# Altium schematic sheet 09-NORStatusLed.SchDoc
size A4; DocumentNumber: 9; SheetNumber: 9; SheetTotal: 26
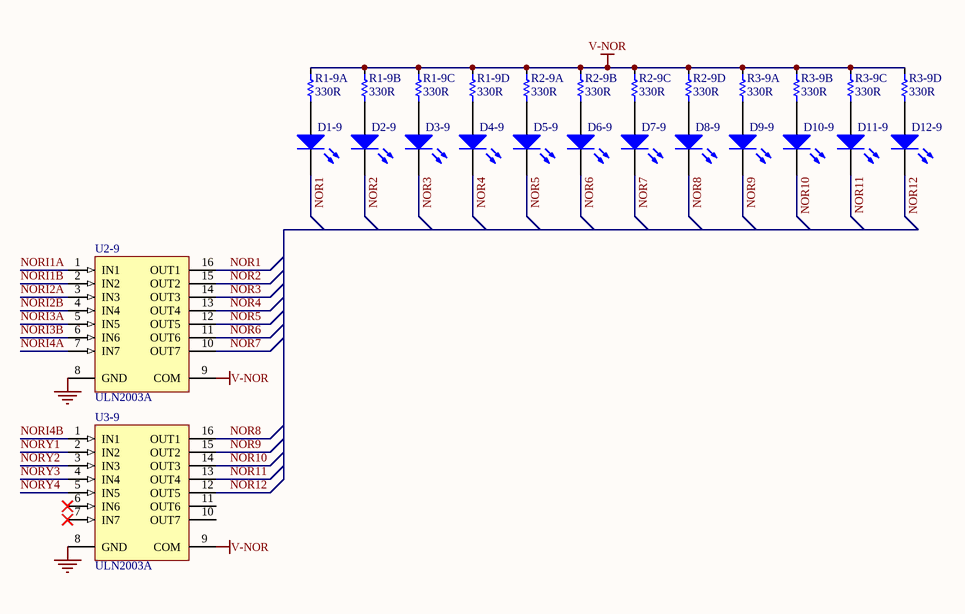
[diagram p0: 09-NORStatusLed.SchDoc]

## Parts
D1-9  LED  [LED-0805]  (value not drawn)
D2-9  LED  [LED-0805]  (value not drawn)
D3-9  LED  [LED-0805]  (value not drawn)
D4-9  LED  [LED-0805]  (value not drawn)
D5-9  LED  [LED-0805]  (value not drawn)
D6-9  LED  [LED-0805]  (value not drawn)
D7-9  LED  [LED-0805]  (value not drawn)
D8-9  LED  [LED-0805]  (value not drawn)
D9-9  LED  [LED-0805]  (value not drawn)
D10-9  LED  [LED-0805]  (value not drawn)
D11-9  LED  [LED-0805]  (value not drawn)
D12-9  LED  [LED-0805]  (value not drawn)
R1-9  330R  [R-Array-0603-4]  (parts A,B,C,D of 4)
R2-9  330R  [R-Array-0603-4]  (parts A,B,C,D of 4)
R3-9  330R  [R-Array-0603-4]  (parts A,B,C,D of 4)
U2-9  ULN2003A  [SOIC-16]
U3-9  ULN2003A  [SOIC-16]

## Nets
GND: U2-9.8(GND) U3-9.8(GND)
V-NOR: R1-9.2 R1-9.4 R1-9.6 R1-9.8 R2-9.2 R2-9.4 R2-9.6 R2-9.8 R3-9.2 R3-9.4 R3-9.6 R3-9.8 U2-9.9(COM) U3-9.9(COM)
NOR1: D1-9.2(K) U2-9.16(OUT1)
NOR2: D2-9.2(K) U2-9.15(OUT2)
NOR3: D3-9.2(K) U2-9.14(OUT3)
NOR4: D4-9.2(K) U2-9.13(OUT4)
NOR5: D5-9.2(K) U2-9.12(OUT5)
NOR6: D6-9.2(K) U2-9.11(OUT6)
NOR7: D7-9.2(K) U2-9.10(OUT7)
NOR8: D8-9.2(K) U3-9.16(OUT1)
NOR9: D9-9.2(K) U3-9.15(OUT2)
NOR10: D10-9.2(K) U3-9.14(OUT3)
NOR11: D11-9.2(K) U3-9.13(OUT4)
NOR12: D12-9.2(K) U3-9.12(OUT5)
NORI1A: U2-9.1(IN1)
NORI1B: U2-9.2(IN2)
NORI2A: U2-9.3(IN3)
NORI2B: U2-9.4(IN4)
NORI3A: U2-9.5(IN5)
NORI3B: U2-9.6(IN6)
NORI4A: U2-9.7(IN7)
NORI4B: U3-9.1(IN1)
NORY1: U3-9.2(IN2)
NORY2: U3-9.3(IN3)
NORY3: U3-9.4(IN4)
NORY4: U3-9.5(IN5)
NetD1-9_1: D1-9.1(A) R1-9.1
NetD2-9_1: D2-9.1(A) R1-9.3
NetD3-9_1: D3-9.1(A) R1-9.5
NetD4-9_1: D4-9.1(A) R1-9.7
NetD5-9_1: D5-9.1(A) R2-9.1
NetD6-9_1: D6-9.1(A) R2-9.3
NetD7-9_1: D7-9.1(A) R2-9.5
NetD8-9_1: D8-9.1(A) R2-9.7
NetD9-9_1: D9-9.1(A) R3-9.1
NetD10-9_1: D10-9.1(A) R3-9.3
NetD11-9_1: D11-9.1(A) R3-9.5
NetD12-9_1: D12-9.1(A) R3-9.7

Not connected (* = marked no-connect by the designer): U3-9 6(IN6)* 7(IN7)* 10(OUT7) 11(OUT6)

## Library data of the parts
D1-9 D2-9 D3-9 D4-9 D5-9 D6-9 D7-9 D8-9 D9-9 D10-9 D11-9 D12-9 = LED2: Typical RED, GREEN, YELLOW, AMBER GaAs LED; Published: 8-Jun-2000; LatestRevisionDate: 17-Jul-2002; LatestRevisionNote: Re-released for DXP Platform.; PackageVersion: Feb-2002; PackageReference: 3.2X1.6X1.1; Publisher: Altium Limited; PackageDescription: SM LED; 2 Flat Leads
R1-9 R2-9 R3-9 = Res Array 4: RES ARRAY 4 RES 330 OHM 1206; Manufacturer: Panasonic Electronic Components; Manufacturer Part Number: EXB-38V331JV; Digi-Key Part Number: Y9331TR-ND; Link: http://www.digikey.com/product-detail/en/EXB-38V331JV/Y9331TR-ND/256525
U2-9 U3-9 = ULN2003A: High-Voltage, High-Current Darlington Array; Published: 13-Oct-2000; LatestRevisionDate: 06-Jun-2005; LatestRevisionNote: Stylized 3D Model Added.; DatasheetVersion: 1998; PackageVersion: 1998; PackageReference: A16; Publisher: Altium Limited; PackageDescription: DIP; 16 Leads; Row Spacing 7.62 mm; Pitch 2.54 mm; Code_JEDEC: MS-001-BB; ComponentLink1Description: Manufacturer Link; ComponentLink1URL: http://www.allegromicro.com/